# Altium schematic sheet SA_Sch.SchDoc
size A; SheetNumber: 1; SheetTotal: 1
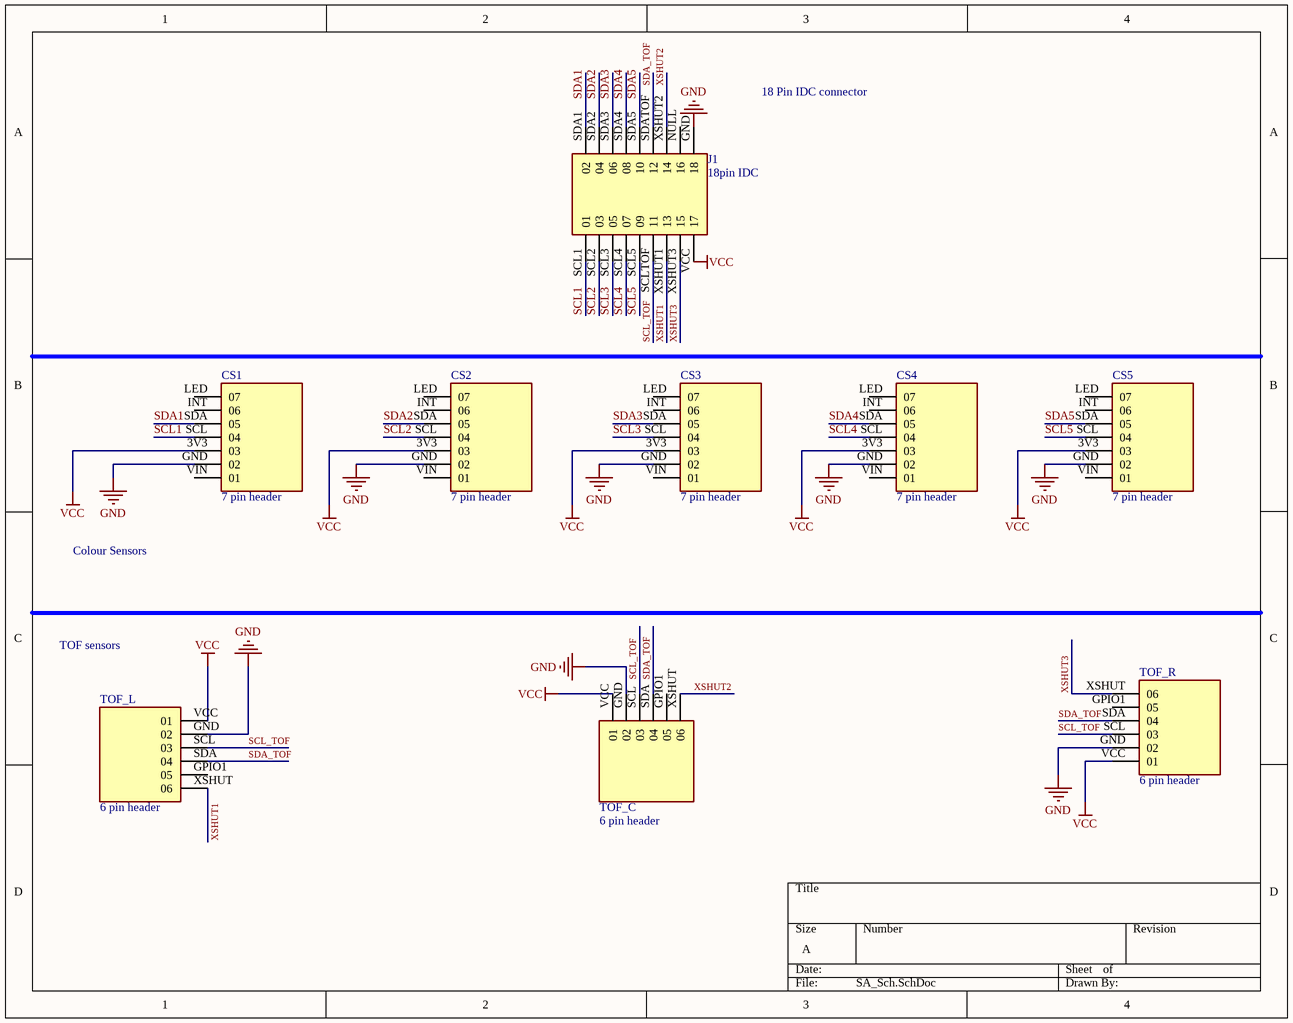
[diagram p0: SA_Sch.SchDoc]

## Parts
CS1  7 pin header  [7 pin header holes]
CS2  7 pin header  [7 pin header holes]
CS3  7 pin header  [7 pin header holes]
CS4  7 pin header  [7 pin header holes]
CS5  7 pin header  [7 pin header holes]
J1  18pin IDC  [IDC 18 pin]
TOF_C  6 pin header  [6 pin header]
TOF_L  6 pin header  [6 pin header]
TOF_R  6 pin header  [6 pin header]

## Nets
GND: CS1.GND(02) CS2.GND(02) CS3.GND(02) CS4.GND(02) CS5.GND(02) J1.GND(18) TOF_C.GND(02) TOF_L.GND(02) TOF_R.GND(02)
VCC: CS1.3V3(03) CS2.3V3(03) CS3.3V3(03) CS4.3V3(03) CS5.3V3(03) J1.VCC(17) TOF_C.VCC(01) TOF_L.VCC(01) TOF_R.VCC(01)
SCL1: CS1.SCL(04) J1.SCL1(01)
SCL2: CS2.SCL(04) J1.SCL2(03)
SCL3: CS3.SCL(04) J1.SCL3(05)
SCL4: CS4.SCL(04) J1.SCL4(07)
SCL5: CS5.SCL(04) J1.SCL5(09)
SCL_TOF: J1.SCLTOF(11) TOF_C.SCL(03) TOF_L.SCL(03) TOF_R.SCL(03)
SDA1: CS1.SDA(05) J1.SDA1(02)
SDA2: CS2.SDA(05) J1.SDA2(04)
SDA3: CS3.SDA(05) J1.SDA3(06)
SDA4: CS4.SDA(05) J1.SDA4(08)
SDA5: CS5.SDA(05) J1.SDA5(10)
SDA_TOF: J1.SDATOF(12) TOF_C.SDA(04) TOF_L.SDA(04) TOF_R.SDA(04)
XSHUT1: J1.XSHUT1(13) TOF_L.XSHUT(06)
XSHUT2: J1.XSHUT2(14) TOF_C.XSHUT(06)
XSHUT3: J1.XSHUT3(15) TOF_R.XSHUT(06)

Not connected (* = marked no-connect by the designer): CS1 INT(06) LED(07) VIN(01); CS2 INT(06) LED(07) VIN(01); CS3 INT(06) LED(07) VIN(01); CS4 INT(06) LED(07) VIN(01); CS5 INT(06) LED(07) VIN(01); J1 NULL(16); TOF_C GPIO1(05); TOF_L GPIO1(05); TOF_R GPIO1(05)

## Notes on the sheet
- 18 Pin IDC connector
- Colour Sensors
- TOF sensors

## Library data of the parts
CS1-CS5 = 7 pin header: 14 Position Header Connector Male Pin Gold; MF: Samtec; MP: TS-114-G-AA; SnapEDA_Link: https://www.snapeda.com/parts/TS-114-G-AA/Samtec/view-part/?ref=snap; Package: None; Value: *; Check_prices: https://www.snapeda.com/parts/TS-114-G-AA/Samtec/view-part/?ref=eda
J1 = 18pin IDC: Slim Body Double-Row IDC Male Assemblies, 0.100 Pitch; MF: SAMTEC; MP: IDMD-10-S-07.00-G; SnapEDA_Link: https://www.snapeda.com/parts/IDMD-10-S-07.00-G/Samtec/view-part/?ref=snap; Package: None; Value: *; Check_prices: https://www.snapeda.com/parts/IDMD-10-S-07.00-G/Samtec/view-part/?ref=eda
TOF_C TOF_L TOF_R = 6 pin header: 6 Position Header Connector Male Pin Gold; MF: Samtec; MP: TS-114-G-AA; SnapEDA_Link: https://www.snapeda.com/parts/TS-114-G-AA/Samtec/view-part/?ref=snap; Package: None; Value: *; Check_prices: https://www.snapeda.com/parts/TS-114-G-AA/Samtec/view-part/?ref=eda